# EAGLE design DicioWRK (EAGLE 7.5.0)
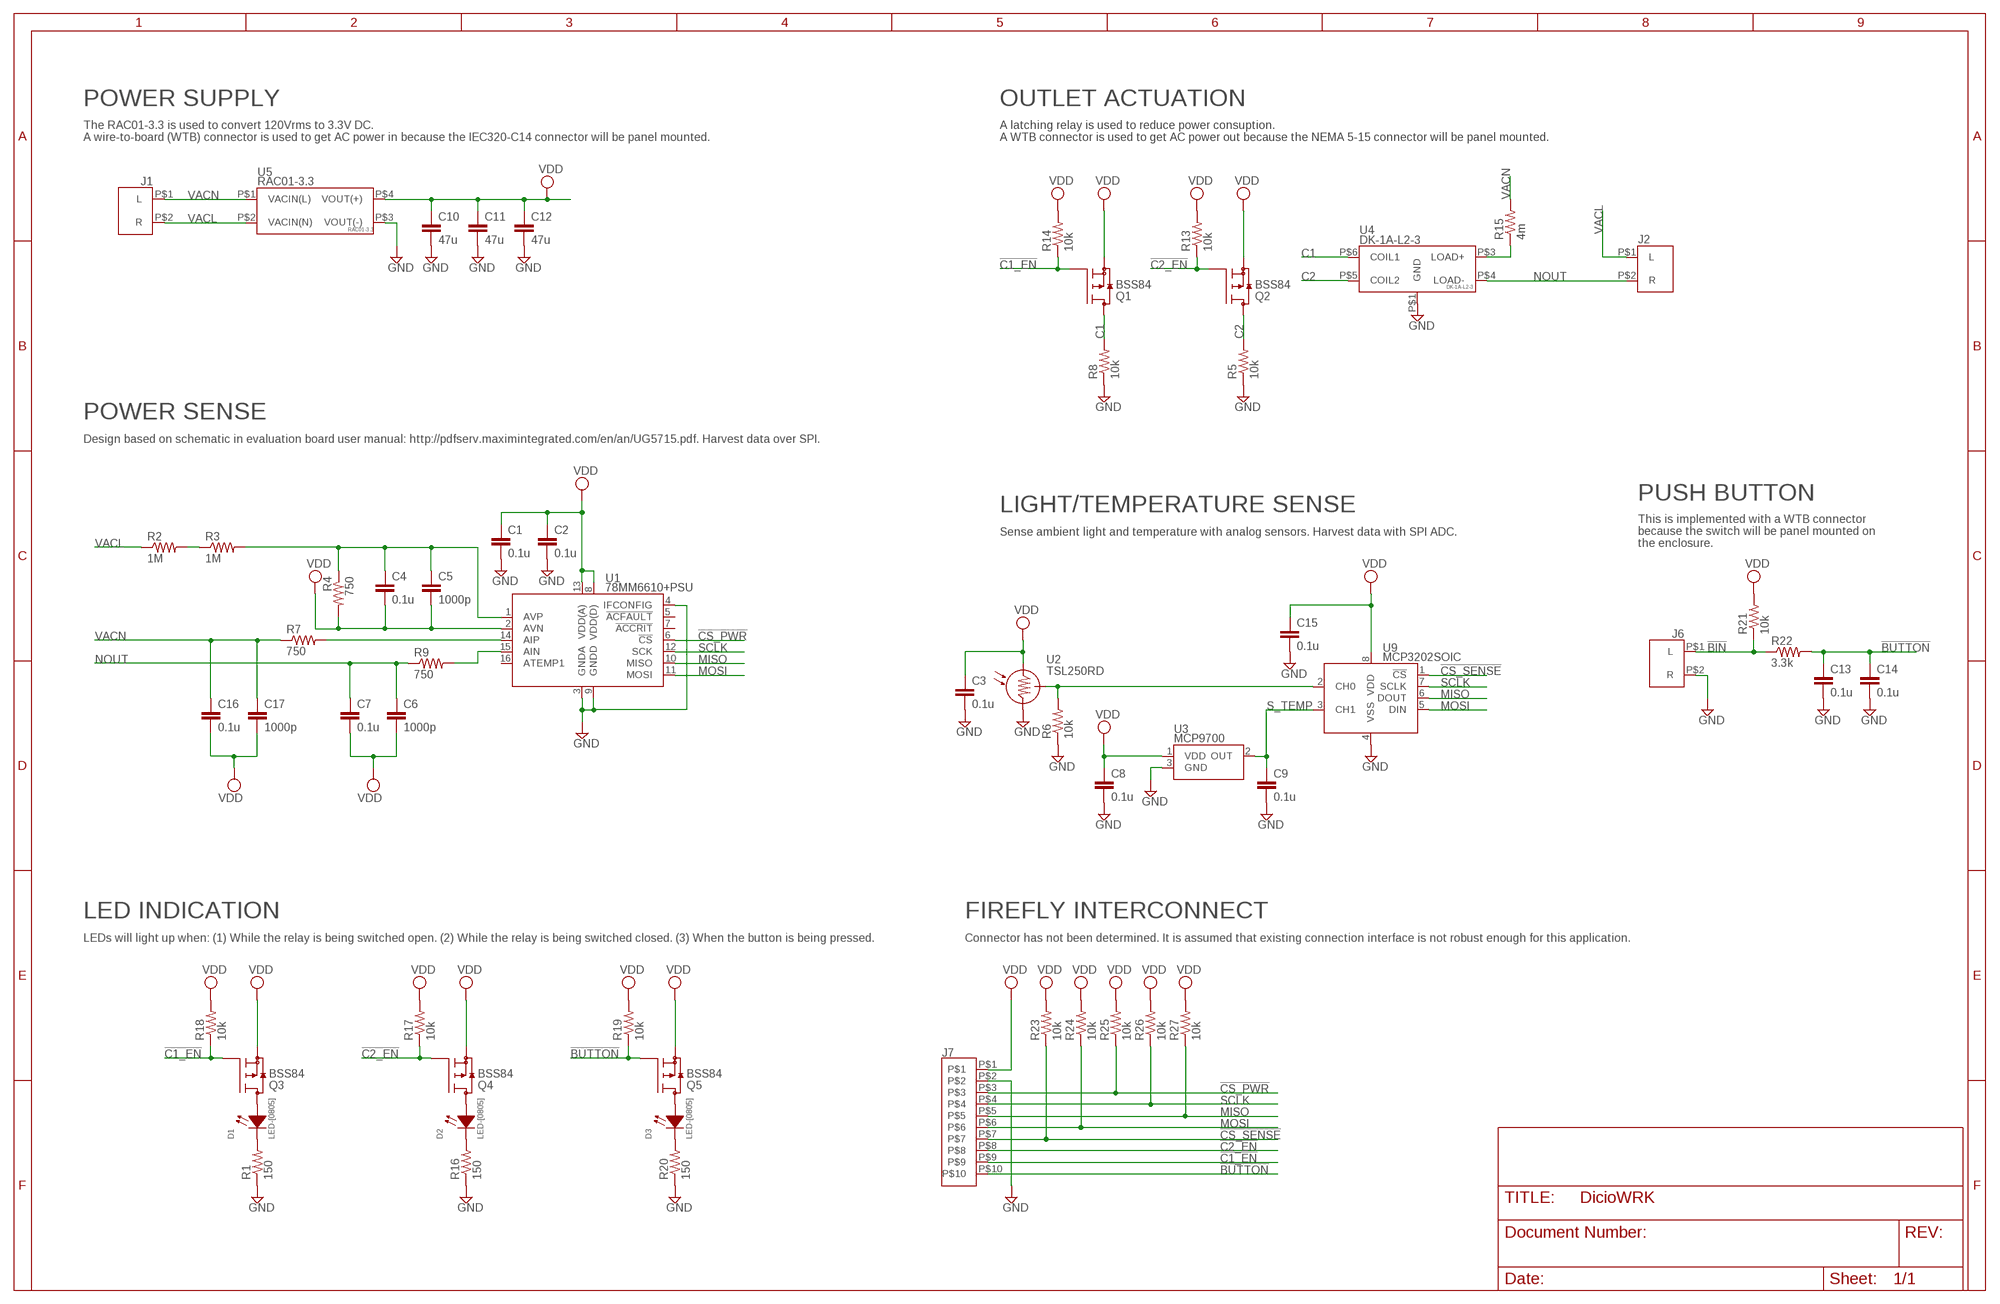
[diagram p0: schematic, sheet 1]

## Parts
C1  0.1u  C-EUC0805  [C0805]
C2  0.1u  C-EUC0805  [C0805]
C3  0.1u  C-EUC0805  [C0805]
C4  0.1u  C-EUC0805  [C0805]
C5  1000p  C-EUC0805  [C0805]
C6  1000p  C-EUC0805  [C0805]
C7  0.1u  C-EUC0805  [C0805]
C8  0.1u  C-EUC0805  [C0805]
C9  0.1u  C-EUC0805  [C0805]
C10  47u  C-EUC1206  [C1206]
C11  47u  C-EUC1206  [C1206]
C12  47u  C-EUC1206  [C1206]
C13  0.1u  C-EUC0805  [C0805]
C14  0.1u  C-EUC0805  [C0805]
C15  0.1u  C-EUC0805  [C0805]
C16  0.1u  C-EUC0805  [C0805]
C17  1000p  C-EUC0805  [C0805]
D1  LED-[0805]  [L0805]
D2  LED-[0805]  [L0805]
D3  LED-[0805]  [L0805]
J1  WTB-2  [[TERM][2][0.2]]
J2  WTB-2  [[TERM][2][0.2]]
J6  WTB-2  [[TERM][2][0.2]]
J7  TERM10  [TERM10]
Q1  BSS84  [SOT23]
Q2  BSS84  [SOT23]
Q3  BSS84  [SOT23]
Q4  BSS84  [SOT23]
Q5  BSS84  [SOT23]
R1  150  R-US_R0805  [R0805]
R2  1M  R-US_R0805  [R0805]
R3  1M  R-US_R0805  [R0805]
R4  750  R-US_R0805  [R0805]
R5  10k  R-US_R0805  [R0805]
R6  10k  R-US_R0805  [R0805]
R7  750  R-US_R0805  [R0805]
R8  10k  R-US_R0805  [R0805]
R9  750  R-US_R0805  [R0805]
R13  10k  R-US_R0805  [R0805]
R14  10k  R-US_R0805  [R0805]
R15  4m  R-US_R2512  [R2512]
R16  150  R-US_R0805  [R0805]
R17  10k  R-US_R0805  [R0805]
R18  10k  R-US_R0805  [R0805]
R19  10k  R-US_R0805  [R0805]
R20  150  R-US_R0805  [R0805]
R21  10k  R-US_R0805  [R0805]
R22  3.3k  R-US_R0805  [R0805]
R23  10k  R-US_R0805  [R0805]
R24  10k  R-US_R0805  [R0805]
R25  10k  R-US_R0805  [R0805]
R26  10k  R-US_R0805  [R0805]
R27  10k  R-US_R0805  [R0805]
U1  78MM6610+PSU  [TSSOP16]
U2  TSL250RD  [SOIC8]
U3  MCP9700  [SOT23]
U4  DK-1A-L2-3  [DK-1A-L2-3]
U5  RAC01-3.3  [RAC01-3.3]
U9  MCP3202SOIC  [SOIC8]

## Nets
!BIN!: J6.P$1(L) R21.1 R22.1
!BUTTON!: C13.1 C14.1 J7.P$10 Q5.1(G) R19.1 R22.2
!C1_EN!: J7.P$9 Q1.1(G) Q3.1(G) R14.1 R18.1
!C2_EN!: J7.P$8 Q2.1(G) Q4.1(G) R13.1 R17.1
!CS_PWR!: J7.P$3 R25.1 U1.6(!CS!)
!CS_SENSE!: J7.P$7 R23.1 U9.1(!CS!)
C1: Q1.3(D) R8.2 U4.P$6(COIL1)
C2: Q2.3(D) R5.2 U4.P$5(COIL2)
GND: C1.2 C2.2 C3.2 C8.2 C9.2 C10.2 C11.2 C12.2 C13.2 C14.2 C15.2 J6.P$2(R) J7.P$2 R1.1 R5.1 R6.1 R8.1 R16.1 R20.1 U1.3(GNDA) U1.4(IFCONFIG) U1.9(GNDD) U2.4(GND) U3.3(GND) U4.P$1(GND) U5.P$3(VOUT(-)) U9.4(VSS)
MISO: J7.P$5 R27.1 U1.10(MISO) U9.6(DOUT)
MOSI: J7.P$6 R24.1 U1.11(MOSI) U9.5(DIN)
N$1: C4.1 C5.1 R3.2 R4.1 U1.1(AVP)
N$3: R2.2 R3.1
N$5: D2.1(A) Q4.3(D)
N$6: R6.2 U2.7(OUT) U9.2(CH0)
N$7: D1.1(A) Q3.3(D)
N$8: R15.1 U4.P$3(LOAD+)
N$10: D1.2(C) R1.2
N$11: D2.2(C) R16.2
N$13: D3.1(A) Q5.3(D)
N$14: D3.2(C) R20.2
N$15: R7.2 U1.14(AIP)
N$17: R9.2 U1.15(AIN)
NOUT: C6.1 C7.1 J2.P$2(R) R9.1 U4.P$4(LOAD-)
S_TEMP: C9.1 U3.2(OUT) U9.3(CH1)
SCLK: J7.P$4 R26.1 U1.12(SCK) U9.7(SCLK)
VACL: J1.P$2(R) J2.P$1(L) R2.1 U5.P$2(VACIN(N))
VACN: C16.1 C17.1 J1.P$1(L) R7.1 R15.2 U5.P$1(VACIN(L))
VDD: C1.1 C2.1 C3.1 C4.2 C5.2 C6.2 C7.2 C8.1 C10.1 C11.1 C12.1 C15.1 C16.2 C17.2 J7.P$1 Q1.2(S) Q2.2(S) Q3.2(S) Q4.2(S) Q5.2(S) R4.2 R13.2 R14.2 R17.2 R18.2 R19.2 R21.2 R23.2 R24.2 R25.2 R26.2 R27.2 U1.2(AVN) U1.8(VDD(D)) U1.13(VDD(A)) U2.6(VDD) U3.1(VDD) U5.P$4(VOUT(+)) U9.8(VDD)
Unconnected: U1.5(!ACFAULT!) U1.7(!ACCRIT!) U1.16(ATEMP1)

## Notes on the sheet
- POWER SUPPLY | OUTLET ACTUATION
- The RAC01-3.3 is used to convert 120Vrms to 3.3V DC.
  A wire-to-board (WTB) connector is used to get AC power in because the IEC320-C14 connector will be panel mounted.
- A latching relay is used to reduce power consuption.
  A WTB connector is used to get AC power out because the NEMA 5-15 connector will be panel mounted.
- POWER SENSE
- Design based on schematic in evaluation board user manual: http://pdfserv.maximintegrated.com/en/an/UG5715.pdf. Harvest data over SPI.
- PUSH BUTTON
- LIGHT/TEMPERATURE SENSE
- Sense ambient light and temperature with analog sensors. Harvest data with SPI ADC.
- This is implemented with a WTB connector
  because the switch will be panel mounted on 
  the enclosure.
- LED INDICATION | FIREFLY INTERCONNECT
- LEDs will light up when: (1) While the relay is being switched open. (2) While the relay is being switched closed. (3) When the button is being pressed. | Connector has not been determined. It is assumed that existing connection interface is not robust enough for this application.

## Library data of the parts
C1-C4 C7-C9 C13-C16 = resistor:C-EU: CAPACITOR, European symbol; DKPN: 399-1249-1-ND
C5 C6 C17 = resistor:C-EU: CAPACITOR, European symbol; DKPN: 311-1127-1-ND
C10-C12 = resistor:C-EU: CAPACITOR, European symbol; DKPN: 311-1993-1-ND
D1 = TORO:LED-[0805]; COLOR: GREEN; DKPN: 160-1218-1-ND
D2 = TORO:LED-[0805]; COLOR: RED; DKPN: 475-1415-1-ND
D3 = TORO:LED-[0805]; COLOR: YELLOW; DKPN: 475-2560-1-ND
J1 J2 J6 = TORO:WTB-2; DKPN: ED2580-ND
J7 = TORO:TERM10
Q1-Q5 = TORO:BSS84; DKPN: BSS84CT-ND
R1 R16 R20 = resistor:R-US_: RESISTOR, American symbol; DKPN: 311-150ARCT-ND
R2 R3 = resistor:R-US_: RESISTOR, American symbol; DKPN: 311-1.00MCRCT-ND
R4 R7 R9 = resistor:R-US_: RESISTOR, American symbol; DKPN: 311-750ARCT-ND
R5 R6 R8 R13 R14 R17-R19 R21 R23-R27 = resistor:R-US_: RESISTOR, American symbol; DKPN: 311-10KARCT-ND
R15 = resistor:R-US_: RESISTOR, American symbol; DKPN: 696-1181-1-ND
R22 = resistor:R-US_: RESISTOR, American symbol; DKPN: 311-3.30KCRCT-ND
U1 = TORO:78MM6610+PSU; DKPN: 78M6610+PSU/C48-ND
U2 = TORO:TSL250RD
U3 = TORO:MCP9700; DKPN: MCP9700T-E/TTCT-ND
U4 = TORO:DK-1A-L2-3; DKPN: 255-2053-ND
U5 = TORO:RAC01-3.3; DKPN: 945-1400-5-ND
U9 = TORO:MCP3202; DKPN: MCP3202-CI/SN-ND

## Board
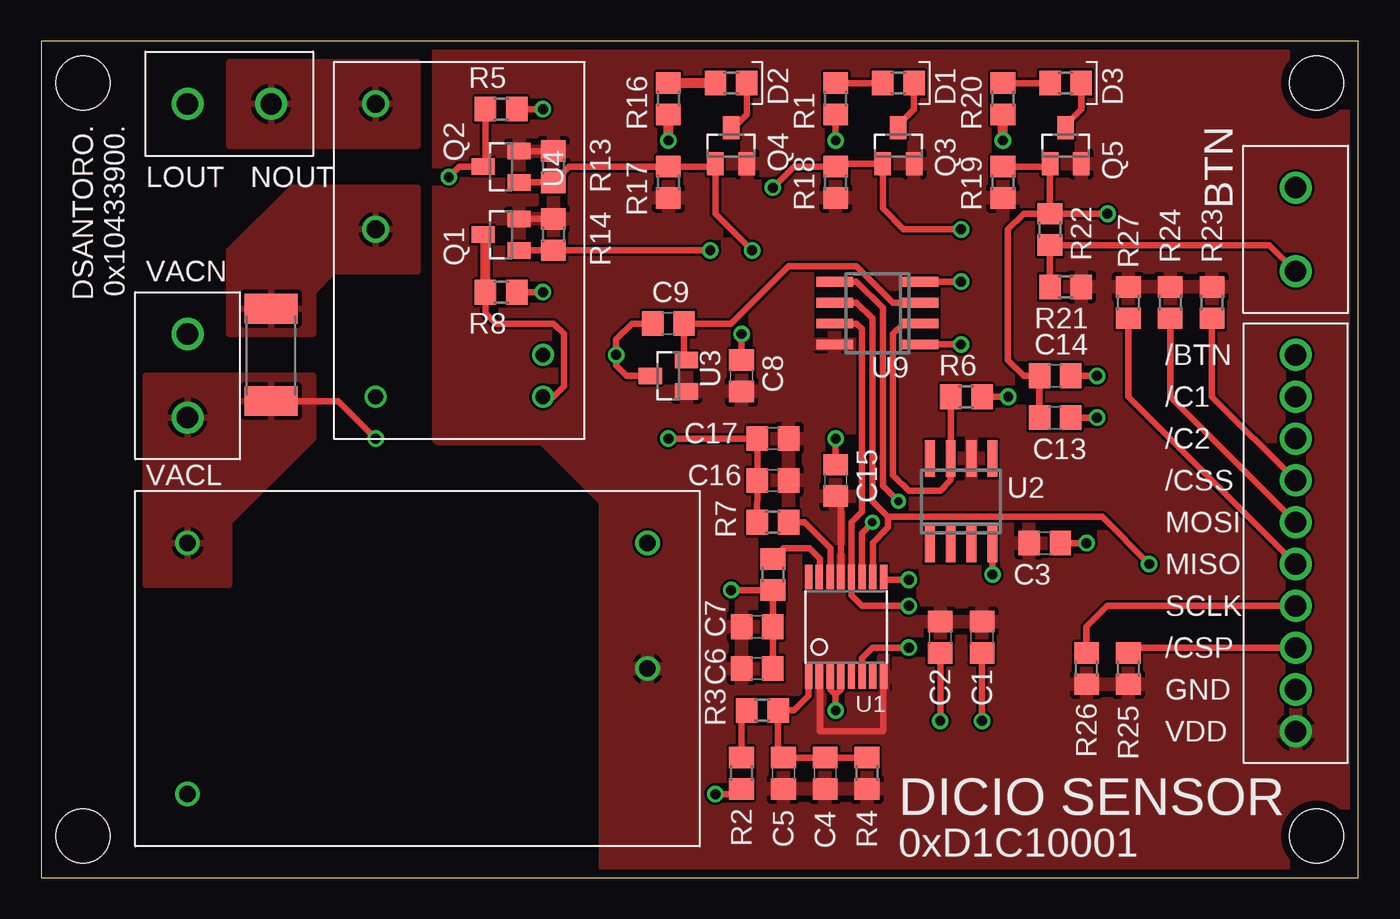
[diagram p1: board, top side]
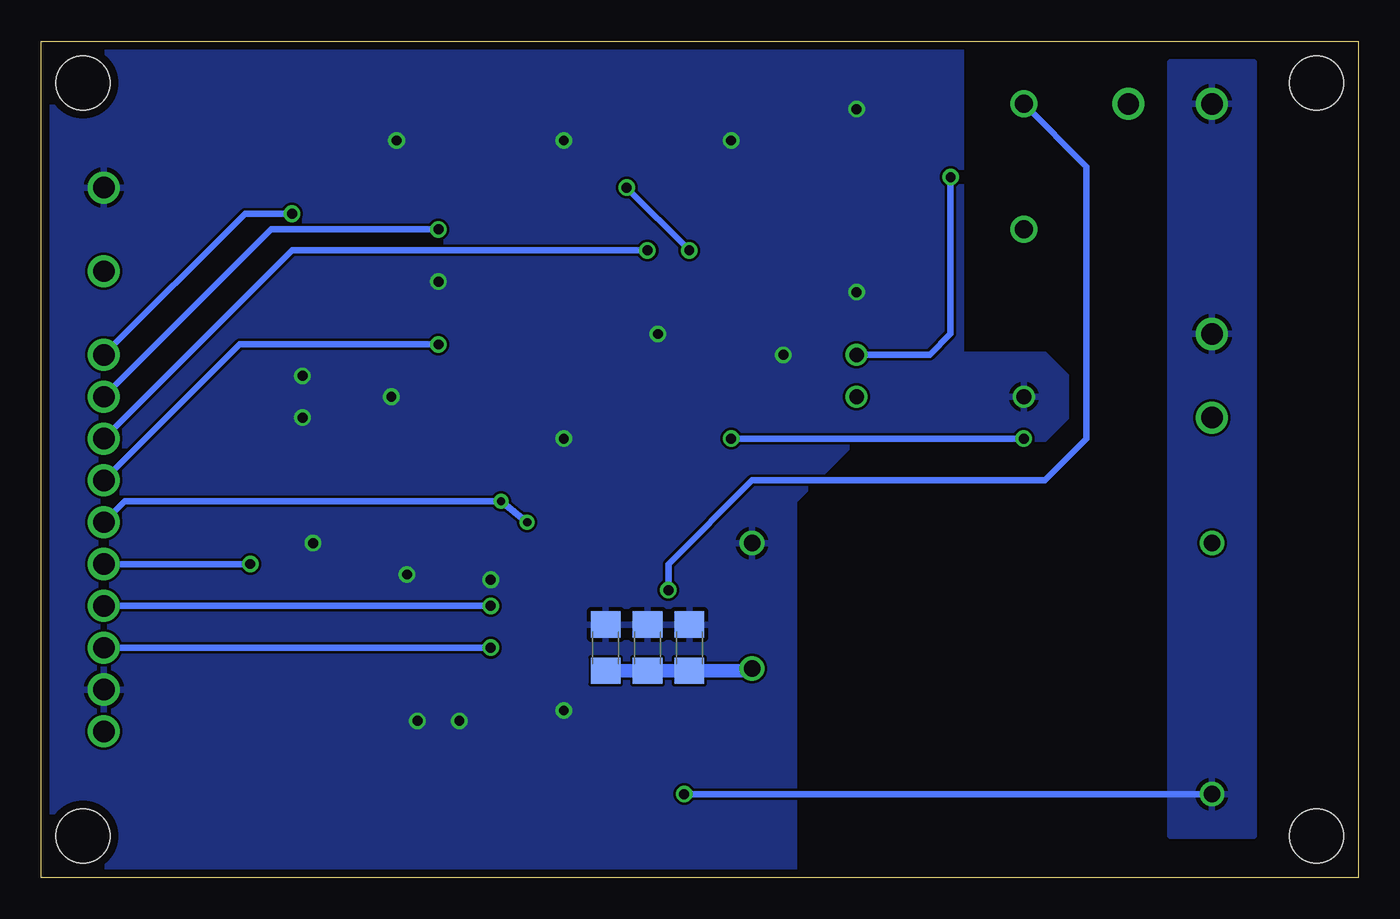
[diagram p2: board, bottom side, seen from below]

Size 80.01 x 50.8 mm. Coordinates in mm from the lower left corner, seen from the top.
Outline: 80,0 80,50.8 0,50.8 0,0 80.01,0
Copper layers (1*16): Top 0.0178mm / dielectric 59mil / Bottom 0.0178mm
Design rules "SSC-EAGLE-2Lyr_v1.0.0.3": minimum track width 6mil, minimum drill 14mil, track to track 6mil, track to pad 6mil, pad to pad 6mil, via to via 6mil, smd to smd 6mil, copper to edge 20mil, drill to drill 16mil, minimum pad ring 8mil, minimum via ring 8mil, stop-mask expansion 3mil, vias tented up to drill 0mil, thermal gap 10mil
Holes 3.26 mm at 77.47,48.26 77.47,2.54 2.54,2.54 2.54,48.26

### Footprints (pad centres in the part's own frame; a part is rotated, then mirrored left to right if it is on the bottom)
C0805 = smd 1.3 x 1.5: 1 -0.95,0; 2 0.95,0
C1206 = smd 1.6 x 1.8: 1 -1.4,0; 2 1.4,0
L0805 = smd 1.3 x 1.5: 1 -0.95,0; 2 0.95,0
[TERM][2][0.2] = drill 1.3: P$1 0,0; P$2 0,-5.08
TERM10 = drill 1.3: P$1 0,0; P$2 0,-2.54; P$3 0,-5.08; P$4 0,-7.62; P$5 0,-10.16; P$6 0,-12.7; P$7 0,-15.24; P$8 0,-17.78; P$9 0,-20.32; P$10 0,-22.86
SOT23 = smd 1 x 1.4: 1 -0.95,-1.1; 2 0.95,-1.1; 3 0,1.1
R0805 = smd 1.3 x 1.5: 1 -0.95,0; 2 0.95,0
R2512 = smd 1.8 x 3.2: 1 -2.8,0; 2 2.8,0
TSSOP16 = smd 0.45 x 1.5: 1 -2.275,-3.022; 2 -1.625,-3.022; 3 -0.975,-3.022; 4 -0.325,-3.022; 5 0.325,-3.022; 6 0.975,-3.022; 7 1.625,-3.022; 8 2.275,-3.022; 9 2.275,3.022; 10 1.625,3.022; 11 0.975,3.022; 12 0.325,3.022; 13 -0.325,3.022; 14 -0.975,3.022; 15 -1.625,3.022; 16 -2.275,3.022
SOIC8 = smd 0.6 x 2.2: 1 -1.905,-2.6; 2 -0.635,-2.6; 3 0.635,-2.6; 4 1.905,-2.6; 5 1.905,2.6; 6 0.635,2.6; 7 -0.635,2.6; 8 -1.905,2.6
DK-1A-L2-3 = drill 0.889: P$1 0,0; P$5 2.54,-10.16; P$6 0,-10.16 | drill 1.092: P$3 10.16,0; P$4 17.78,0
RAC01-3.3 = drill 1: P$1 0,0; P$2 0,-15.24; P$3 27.94,0; P$4 27.94,-7.62

### Placement (x,y rotation side)
C1  57.15,14.61 270 top
C2  54.61,14.61 270 top
C3  60.96,20.32 0 top
C4  47.62,6.35 270 top
C5  45.09,6.35 270 top
C6  43.5,12.7 180 top
C7  43.5,15.24 180 top
C8  42.55,30.48 90 top
C9  38.1,33.66 180 top
C10  45.72,13.97 90 bottom
C11  43.18,13.97 90 bottom
C12  40.64,13.97 90 bottom
C13  61.59,27.94 0 top
C14  61.59,30.48 0 top
C15  48.26,24.13 90 top
C16  44.45,24.13 0 top
C17  44.45,26.67 0 top
D1  52.07,48.26 180 top
D2  41.91,48.26 180 top
D3  62.23,48.26 180 top
J1  8.89,27.94 180 top
J2  8.89,46.99 90 top
J6  76.2,36.83 180 top
J7  76.2,8.89 180 top
Q1  27.94,39.05 90 top
Q2  27.94,43.18 90 top
Q3  52.07,44.45 0 top
Q4  41.91,44.45 0 top
Q5  62.23,44.45 0 top
R1  48.26,47.31 90 top
R2  42.55,6.35 90 top
R3  43.81,10.16 0 top
R4  50.16,6.35 270 top
R5  27.94,46.67 180 top
R6  56.2,29.21 180 top
R7  44.45,21.59 0 top
R8  27.94,35.56 180 top
R9  44.45,18.42 90 top
R13  31.11,43.18 90 top
R14  31.11,39.05 90 top
R15  13.97,31.75 270 top
R16  38.1,47.31 90 top
R17  38.1,42.23 270 top
R18  48.26,42.23 270 top
R19  58.42,42.23 270 top
R20  58.42,47.31 90 top
R21  62.23,35.88 0 top
R22  61.28,39.37 90 top
R23  71.12,34.93 90 top
R24  68.58,34.93 90 top
R25  66.04,12.7 270 top
R26  63.5,12.7 270 top
R27  66.04,34.93 90 top
U1  48.9,15.24 0 top
U2  55.88,22.86 0 top
U3  38.1,30.48 90 top
U4  20.32,29.21 90 top
U5  8.89,20.32 0 top
U9  50.8,34.29 90 top

### Tracks (layer width: path | path; a pad name or v marks a point on that pad's centre or on a via)
!BIN!
  Top 0.406: R21.1 R22.1 67.63,38.42 74.61,38.42 J6.P$1
!BUTTON!  (via drill 0.6)
  Top 0.406: R19.1 61.11,43.18 | R22.2 61.11,40.49 61.28,40.49 Q5.1 | R22.2 59.69,40.32 58.73,39.37 58.73,31.75 58.74,31.75 58.74,31.43 59.69,30.48 C14.1 C13.1 | R22.2 | R22.2 v64.77,40.32
  Top 0.61: 61.11,43.18 Q5.1
  Bottom 0.406: J7.P$10 67.63,40.32 v64.77,40.32
!C1_EN!  (via drill 0.6)
  Top 0.406: Q1.1 R14.1 | 48.43,43.35 Q3.1 51.12,41.91 51.12,40.64 52.39,39.37 v55.88,39.37 | R18.1 45.72,43.18 v44.45,41.91 | v40.64,38.1 R14.1 | R14.1 30.48,38.1
  Top 0.61: 29.21,37.93 Q1.1 | 48.43,43.35 R18.1
  Bottom 0.406: v44.45,41.91 v40.64,38.1 | J7.P$9 66.04,39.37 v55.88,39.37
!C2_EN!  (via drill 0.6)
  Top 0.406: Q2.1 R13.1 32.06,43.18 R17.1 40.79,43.18 | Q4.1 40.96,40.32 v43.18,38.1
  Top 0.61: R13.1 | 40.79,43.18 Q4.1
  Bottom 0.406: v43.18,38.1 64.77,38.1 J7.P$8
!CS_PWR!  (via drill 0.6)
  Top 0.406: J7.P$3 66.04,13.97 R25.1 | U1.6 49.85,12.24 49.85,13.34 50.48,13.97 v52.7,13.97
  Bottom 0.406: v52.7,13.97 J7.P$3
!CS_SENSE!  (via drill 0.6)
  Top 0.406: U9.1 v55.88,32.39 | J7.P$7 71.12,29.21 R23.1
  Bottom 0.406: v55.88,32.39 67.94,32.39 J7.P$7
C1
  Top 0.406: R8.2 26.99,34.29 27.62,33.66 31.11,33.66 31.75,33.02 31.75,29.85 31.11,29.21 U4.P$6
  Top 0.61: R8.2 26.99,38.9 Q1.3
C2  (via drill 0.6)
  Top 0.406: R5.2 26.99,43.33 | Q2.3 25.4,43.18 v24.77,42.55
  Top 0.61: 26.99,43.33 Q2.3
  Bottom 0.406: v24.77,42.55 24.77,33.02 26.04,31.75 U4.P$5
GND  (via drill 0.6)
  Top 0.406: R5.1 v30.48,46.67 | R8.1 v30.48,35.56 | C9.2 35.88,33.66 34.92,32.7 v34.92,31.75 34.92,31.12 35.56,30.48 U3.3 | U1.3 47.94,12.45 47.94,11.43 48.26,11.11 | U1.4 48.58,12.47 48.58,11.43 48.26,11.11 | 48.26,11.11 v48.26,10.16 | U1.9 51.26,18.1 v52.7,18.1 | C2.2 v54.61,9.53 | C1.2 v57.15,9.53 | v64.14,27.94 C13.2 | v64.14,30.48 C14.2 | 53.34,36.2 U9.4 v55.88,36.2 | C15.2 v48.26,26.67 | R6.1 v58.74,29.21 | C3.2 v63.5,20.32 | v42.55,33.02 C8.2 | U2.4 v57.78,18.42 | R1.1 v48.26,44.77
  Top 0.61: v58.42,44.77 R20.1 | v38.1,44.77 R16.1
  pour Bottom: 80.01,50.8 24.13,50.8 24.13,31.75 19.05,31.75 17.78,30.48 17.78,27.94 19.05,26.67 30.48,26.67 34.29,22.86 34.29,0 80.01,0
MISO  (via drill 0.6)
  Top 0.406: U9.6 49.53,34.93 50.48,33.97 50.48,22.86 51.44,21.91 | 51.44,21.91 51.44,21.27 50.52,20.36 U1.10 | J7.P$5 66.04,29.21 R27.1 | 51.44,21.91 64.45,21.91 v67.31,19.05
  Bottom 0.406: v67.31,19.05 J7.P$5
MOSI  (via drill 0.5)
  Top 0.406: U9.5 49.53,36.2 51.12,34.61 51.12,23.81 v52.07,22.86 | v50.48,21.59 49.87,20.93 U1.11 | J7.P$6 68.58,29.21 R24.1
  Bottom 0.406: v50.48,21.59 v52.07,22.86 74.93,22.86 J7.P$6
N$1
  Top 0.406: U1.1 46.62,11.06 45.72,10.16 R3.2 44.77,7.62 C5.1 C4.1 R4.1
N$3
  Top 0.406: 42.55,10.03 42.67,10.16 R3.1 42.55,10.16 R2.2
N$5
  Top 0.406: 42.06,45.55 42.86,46.36 D2.1
  Top 0.61: Q4.3 42.06,45.55 | D2.1
N$6
  Top 0.406: U9.2 52.39,33.66 51.75,33.02 51.75,24.45 52.7,23.5 54.61,23.5 55.24,24.13 U2.7 R6.2
N$7
  Top 0.406: 52.07,45.72 53.02,46.67 D1.1
  Top 0.61: Q3.3 52.07,45.72 | D1.1
N$8
  pour Top: 11.43,33.02 11.43,38.1 15.24,41.91 22.86,41.91 22.86,36.83 17.78,36.83 16.51,35.56 16.51,33.02
N$10
  Top 0.406: D1.2 R1.2
N$11
  Top 0.61: D2.2 R16.2
N$13
  Top 0.406: 62.23,45.72 63.18,46.67 D3.1
  Top 0.61: Q5.3 62.23,45.72 | D3.1
N$14
  Top 0.406: D3.2 R20.2
  Top 0.61: R20.2
N$15
  Top 0.406: U1.14 47.94,18.03 47.94,20 46.35,21.59 R7.2
N$17
  Top 0.406: 47.31,18.05 U1.15 47.31,18.3 47.31,19.37 46.67,20 45.09,20 R9.2
NOUT  (via drill 0.6)
  Top 0.406: C6.1 C7.1 R9.1 42.23,17.47 arc-90 v41.91,17.46
  Bottom 0.406: U4.P$4 16.51,43.18 16.51,26.67 19.05,24.13 36.83,24.13 41.91,19.05 v41.91,17.46
  pour Top: 11.43,49.53 11.43,44.45 22.86,44.45 22.86,49.53
S_TEMP
  Top 0.406: U3.2 39.05,31.58 C9.1 41.91,33.66 45.4,37.15 49.53,37.15 51.75,34.93 U9.3
SCLK  (via drill 0.6)
  Top 0.406: U9.7 49.53,33.66 49.85,33.34 49.85,22.23 49.22,21.6 U1.12 49.22,17.15 49.21,17.15 49.85,16.51 v52.7,16.51 | J7.P$4 64.77,16.51 63.5,15.24 R26.1
  Bottom 0.406: v52.7,16.51 J7.P$4
VACL  (via drill 0.6)
  Top 0.406: R2.1 42.23,5.08 v40.96,5.08
  Bottom 0.406: U5.P$2 v40.96,5.08
  pour Bottom: 11.43,2.54 6.35,2.54 6.35,49.53 11.43,49.53
VACN  (via drill 0.6)
  Top 0.406: R7.1 C16.1 C17.1 v38.1,26.67 | R15.2 18.04,28.95 v20.32,26.67
  Bottom 0.406: v20.32,26.67 v38.1,26.67
  pour Top: 6.35,30.48 6.35,17.78 11.43,17.78 11.43,21.59 16.51,26.67 16.51,30.48
VDD
  Top 0.406: R13.2 Q2.2 | R14.2 Q1.2 | C15.1 48.57,22.87 U1.13 | U1.2 47.31,12.18 47.31,8.89 51.12,8.89 51.17,8.94 U1.8
  Bottom 0.406: U5.P$4 36.96,12.57
  Bottom 0.813: 36.96,12.57 C12.1 C11.1 C10.1
  pour Top: 24.13,50.8 80.01,50.8 80.01,0 34.29,0 34.29,22.86 30.48,26.67 24.13,26.67

### Text on the board
tPlace: LOUT | NOUT | BTN | VACN | /BTN | /C1 | /C2 | VACL | /CSS | MOSI | MISO | SCLK | /CSP | GND | VDD | DICIO SENSOR | 0xD1C10001
tNames: DSANTORO. / 0x10433900.